# Altium schematic sheet Sheet1.SchDoc
size A; SheetNumber: 1; SheetTotal: 1
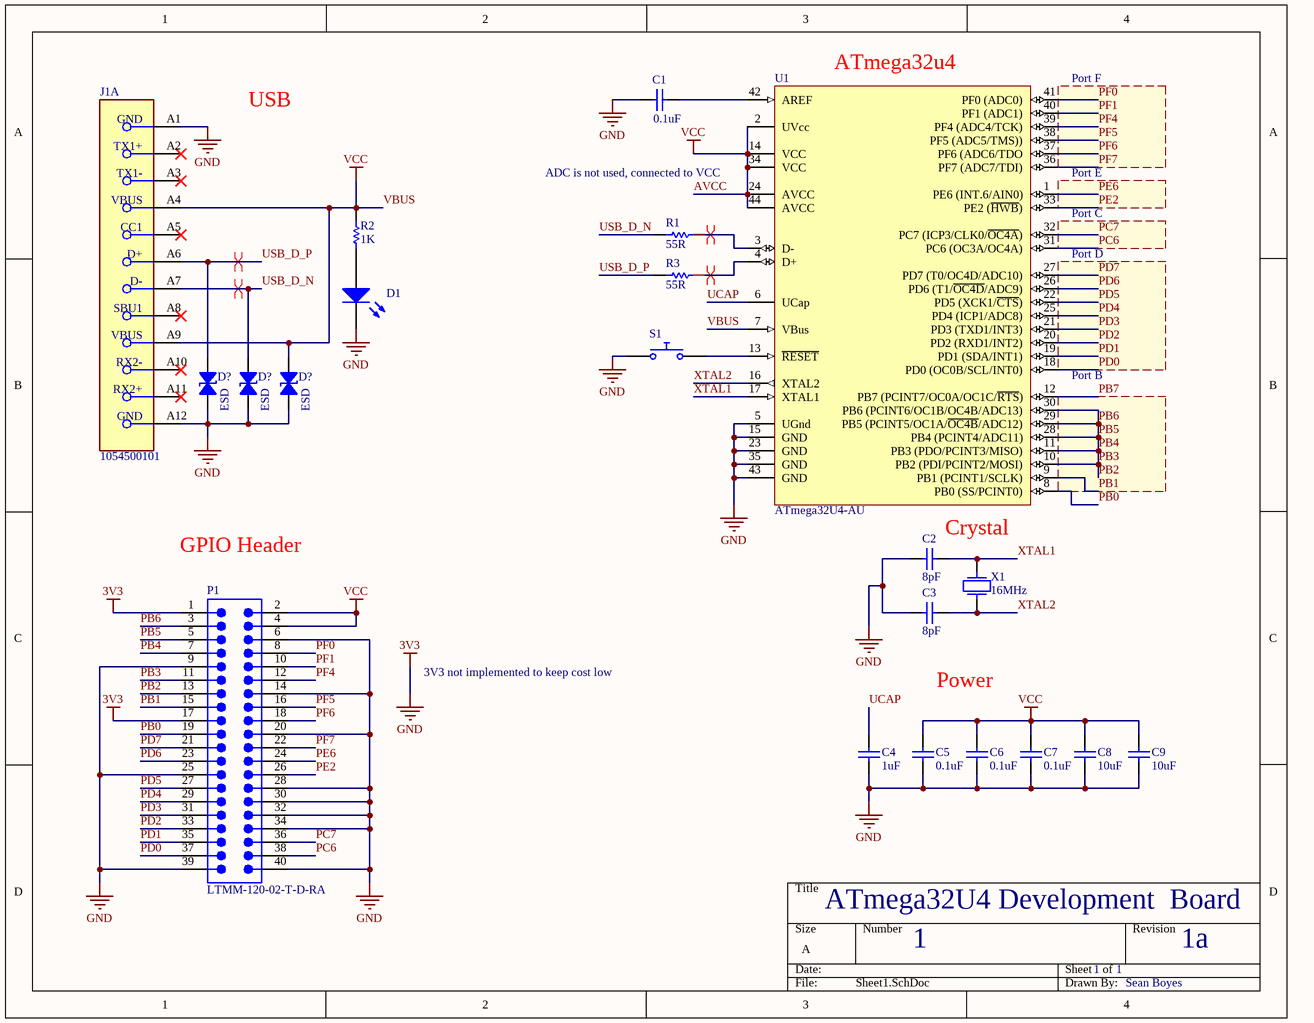
[diagram p0: Sheet1.SchDoc]

## Parts
(Parts that share a designator on the sheet are numbered #1, #2 ... from top to bottom, then left to right.)
C1  value 0.1uF  (hidden comment: Capacitor)
C2  value 8pF  (hidden comment: Capacitor)
C3  value 8pF  (hidden comment: Capacitor)
C4  value 1uF  (hidden comment: Capacitor)
C5  value 0.1uF  (hidden comment: Capacitor)
C6  value 0.1uF  (hidden comment: Capacitor)
C7  value 0.1uF  (hidden comment: Capacitor)
C8  value 10uF  (hidden comment: Capacitor)
C9  value 10uF  (hidden comment: Capacitor)
D1  Light-Emitting Diode  (value not drawn)
D?#1  ESD  [0402]
D?#2  ESD  [0402]
D?#3  ESD  [0402]
J1  1054500101  [FP-1054500101-MFG]  (part A of 3)
P1  LTMM-120-02-T-D-RA  [SMTC-LTMM-120-02-X-D-RA]
R1  value 55R  (hidden comment: Resistor)
R2  value 1K  (hidden comment: Resistor)
R3  value 55R  (hidden comment: Resistor)
S1  Push Button Normally Opened  (value not drawn)
U1  ATmega32U4-AU  [44ML_M]
X1  F0: 16MHz  (hidden comment: Crystal)

## Nets
3V3: C1.1 C2.1 C3.1 C4.1 C5.1 C6.1 C7.1 C8.1 C9.1 D1.2(K) D?#1.2 D?#2.2 D?#3.2 J1.A1(GND) J1.A12(GND) P1.1 P1.6 P1.9 P1.14 P1.17 P1.20 P1.25 P1.28 P1.30 P1.32 P1.34 P1.39 P1.40 S1.1 U1.5(UGnd) U1.15(GND) U1.23(GND) U1.35(GND) U1.43(GND)  [also labelled GND]
AVCC: C5.2 C6.2 C7.2 C8.2 C9.2 D?#3.1 J1.A4(VBUS) J1.A9(VBUS) P1.2 P1.4 R2.2 U1.2(UVcc) U1.7(VBus) U1.14(VCC) U1.24(AVCC) U1.34(VCC) U1.44(AVCC)  [also labelled VBUS, VCC]
PB0: P1.19 U1.8(PB0_(SS/PCINT0))
PB1: P1.15 U1.9(PB1_(PCINT1/SCLK))
PB2: P1.3 P1.5 P1.7 P1.11 P1.13 U1.10(PB2_(PDI/PCINT2/MOSI)) U1.11(PB3_(PDO/PCINT3/MISO)) U1.28(PB4_(PCINT4/ADC11)) U1.29(PB5_(PCINT5/OC1A/~{OC4B}/ADC12)) U1.30(PB6_(PCINT6/OC1B/OC4B/ADC13))  [also labelled PB3, PB4, PB5, PB6]
PB7: U1.12(PB7_(PCINT7/OC0A/OC1C/~{RTS}))
PC6: P1.38 U1.31(PC6_(OC3A/OC4A))
PC7: P1.36 U1.32(PC7_(ICP3/CLK0/~{OC4A}))
PD0: P1.37 U1.18(PD0_(OC0B/SCL/INT0))
PD1: P1.35 U1.19(PD1_(SDA/INT1))
PD2: P1.33 U1.20(PD2_(RXD1/INT2))
PD3: P1.31 U1.21(PD3_(TXD1/INT3))
PD4: P1.29 U1.25(PD4_(ICP1/ADC8))
PD5: P1.27 U1.22(PD5_(XCK1/~{CTS}))
PD6: P1.23 U1.26(PD6_(T1/~{OC4D}/ADC9))
PD7: P1.21 U1.27(PD7_(T0/OC4D/ADC10))
PE2: P1.26 U1.33(PE2_(~{HWB}))
PE6: P1.24 U1.1(PE6_(INT.6/AIN0))
PF0: P1.8 U1.41(PF0_(ADC0))
PF1: P1.10 U1.40(PF1_(ADC1))
PF4: P1.12 U1.39(PF4_(ADC4/TCK))
PF5: P1.16 U1.38(PF5_(ADC5/TMS)))
PF6: P1.18 U1.37(PF6_(ADC6/TDO)
PF7: P1.22 U1.36(PF7_(ADC7/TDI))
UCAP: C4.2 U1.6(UCap)
USB_D_N: D?#2.1 J1.A7(D-) R1.1
USB_D_P: D?#1.1 J1.A6(D+) R3.1
XTAL1: C2.2 U1.17(XTAL1) X1.2
XTAL2: C3.2 U1.16(XTAL2) X1.1
NetC1_2: C1.2 U1.42(AREF)
NetD1_1: D1.1(A) R2.1
NetR1_2: R1.2 U1.3(D-)
NetR3_2: R3.2 U1.4(D+)
NetS1_2: S1.2 U1.13(~{RESET})

Not connected (* = marked no-connect by the designer): J1 A2(TX1+)* A3(TX1-)* A5(CC1)* A8(SBU1)* A10(RX2-)* A11(RX2+)*

## Layout directives
differential pair: (no net found under the mark), USB_D_N, USB_D_P

## Notes on the sheet
- (near U1) ATmega32u4
- (near U1) Port F
- USB
- (near U1) ADC is not used, connected to VCC
- (near U1) Port E
- (near U1) Port C
- (near U1) Port D
- (near U1) Port B
- GPIO Header
- Crystal
- 3V3 not implemented to keep cost low
- Power
- ATmega32U4 Development  Board
- 1
- 1a
- Sean Boyes

## Library data of the parts
C1-C9 = Capacitor: SimulationGenericComponent: True
D1 = LED: AF: 1; BV: 0; BV_MAX: 1e99; EG: 1.11; FC: 0.5; IBV: 0.001; IS: 1e-14; MJSW: 0.33; NTUN: 30; TNOM: 27; XTI: 3; SimulationGenericComponent: True; CJO: 0; CJP: 0; CTA: 0; CTP: 0; FCS: 0.5; FV_MAX: 1e99; IKF: 0; IKR: 0; ISR: 1e-14; JSW: 0; JTUN: 0; JTUNSW: 0; KEG: 1; KF: 0; LEVEL: 1; N: 1; NBV: 1; NR: 1; NS: 1; PHP: 1; RS: 0; TCV: 0; TLEV: 0; TLEVC: 0; TM1: 0; TM2: 0; TPB: 0; TPHP: 0; TRS: 0; TRS2: 0; TT: 0; TTT1: 0; TTT2: 0; VJ: 1; XTITUN: 3
D?#1-D?#3 = CMP-004-08678-1: TVS DIODE 5V 8.2V 2X2DFN; Part Number: ESDM3051N2T5G; Manufacturer: ON Semiconductor; Power Line Protection: No; Voltage - Reverse Standoff (Typ): 5V (Max); Type: Zener; Voltage - Breakdown (Min): 5.1V; Capacitance @ Frequency: 21pF @ 1MHz (Max); Current - Peak Pulse (10/1000µs): 8A; Bidirectional Channels: 1; PartId: 10501; Price: 0.04; ComponentLink1Description: Datasheet; Minimum Order: 1; ComponentLink1URL: https://www.onsemi.com/pub/Collateral/ESDM3051-D.PDF; Operating Temperature: -55°C ~ 150°C (TJ); LastUpdated: 2023-09-28 8:41:31 PM; Device Package: 0402 (1006 Metric); ComponentLink2URL: http://digikey.com/product-detail/en/on-semiconductor/ESDM3051N2T5G/ESDM3051N2T5GOSCT-ND/8024483; Case/Package: 0402 (1006 Metric); Applications: USB; Mounting Type: Surface Mount; Part Status: Active; Lifecycle Status: Active; Supplier Device Package: 2-X2DFN (1x0.6); Series: -; ComponentLink2Description: DigiKey Link; Packaging: TapeAndReel; Voltage - Clamping (Max) @ Ipp: 8.2V
J1 = CMP-04767-000004-1: CONN RCP USB3.1 TYPEC 24P SMD RA; Manufacturer: Molex; Number Of Contacts: 24; Description: USB Shielded I/O Receptacle; Type C; Right Angle; Surface Mount; Gold over Nickel; Voltage Rating: 30V; Shielding: true; Is Female: yes; Current Rating: 0.25/1.25/5A; Pitch: 0.5mm; Conn Orientation: Right Angle; Package: 0; Height: 3.44mm; Footprint Url: https://www.molex.com/pdm_docs/sd/1054500101_sd.pdf; Device Class L1: Connectors; Category: Conn; Device Class L2: USB Connectors; Digikey Description: CONN RCP USB3.1 TYPEC 24P SMD RA; Contact Material: Gold,Nickel; Mouser Description: USB Shielded I/O Receptacle; Type C; Right Angle; Surface Mount; Gold over Nickel; ComponentLink2Description: Datasheet; Lead Free: Yes; Automotive: No; Temperature Range High: +85°C; RoHS: TRUE; Octopart: https://octopart.com/105450-0101-molex-68082325; ComponentLink2URL: https://www.molex.com/webdocs/datasheets/pdf/en-us/1054500101_IO_CONNECTORS.pdf; Temperature: -30°C to +85°C; Usb Standard: USB 3.1; Temperature Range Low: -30°C; Device Class L3: unset; Manufacturer Part Number: 1054500101
P1 = CMP-1028-00049-1: Shrouded Header & Stacker, Through-Hole, Right Angle, -55 to 105 degC, 2 mm Pitch, 40-Pin, Male, RoHS; Manufacturer: Samtec; Pitch: 2 mm; ComponentLink3URL: http://www.samtec.com/documents/webfiles/cpdf/LTMM-1XX-XX-XX-D-XX-XX-MKT.pdf; Temperature Range: -55 to 105 degC; PartNumber: LTMM-120-02-T-D-RA; Orientation: Right Angle; ComponentLink2URL: http://d2a072wq521u33.cloudfront.net/catalog_english//LTMM.PDF; PackageDescription: LTMM Assembly; PackageReference: LTMM-120-02-X-D-RA; RoHS: True; DatasheetVersion: F-214; ComponentLink1URL: http://www.samtec.com; ComponentLink1Description: Manufacturer URL; ComponentLink3Description: Package Specification; PackageVersion: AQ, 5/1992; ComponentLink2Description: Datasheet; Mounting Technology: Through-hole
R1-R3 = Resistor: TC1: 0; SimulationGenericComponent: True; TC2: 0
S1 = Push Button NO: closed: 0; Rclosed: 1m; Ropen: 1Meg; SimulationGenericComponent: True
U1 = CMP-0095-00285-2: 8-bit AVR Microcontroller, 2.7-5.5V, 16MHz, 32KB Flash, 1KB EEPROM, 2.5KB SRAM, USB Controller, 44-pin TQFP, Industrial Grade (-40°C to 85°C), Ext Osc; RevisionNote: DatasheetVersion updated. URLs added.; ComponentLink1Description: Manufacturer URL; PackageDescription: 44-Pin Plastic Thin Quad Flat Pack, 10 x 10 x 1.0 mm Body, 0.8 mm Pitch (TQFP); DatasheetVersion: revF, Nov-2010; ComponentLink2URL: http://www.atmel.com/dyn/resources/prod_documents/doc7766.pdf; ComponentLink1URL: http://www.atmel.com/; PackageReference: 44ML; ComponentLink2Description: ATmega16U4/32U4 Datasheet; PackageVersion: rev.G, Jul-2007; ComponentLink3URL: http://www.atmel.com/dyn/resources/prod_documents/7766S.pdf; ComponentLink3Description: ATmega16U4 ATmega32U4 Summary
X1 = Crystal: R: 500; Q: 50K; SimulationGenericComponent: True